# EAGLE design 10001_msp430_bsl_programmer (EAGLE 9.0.1)
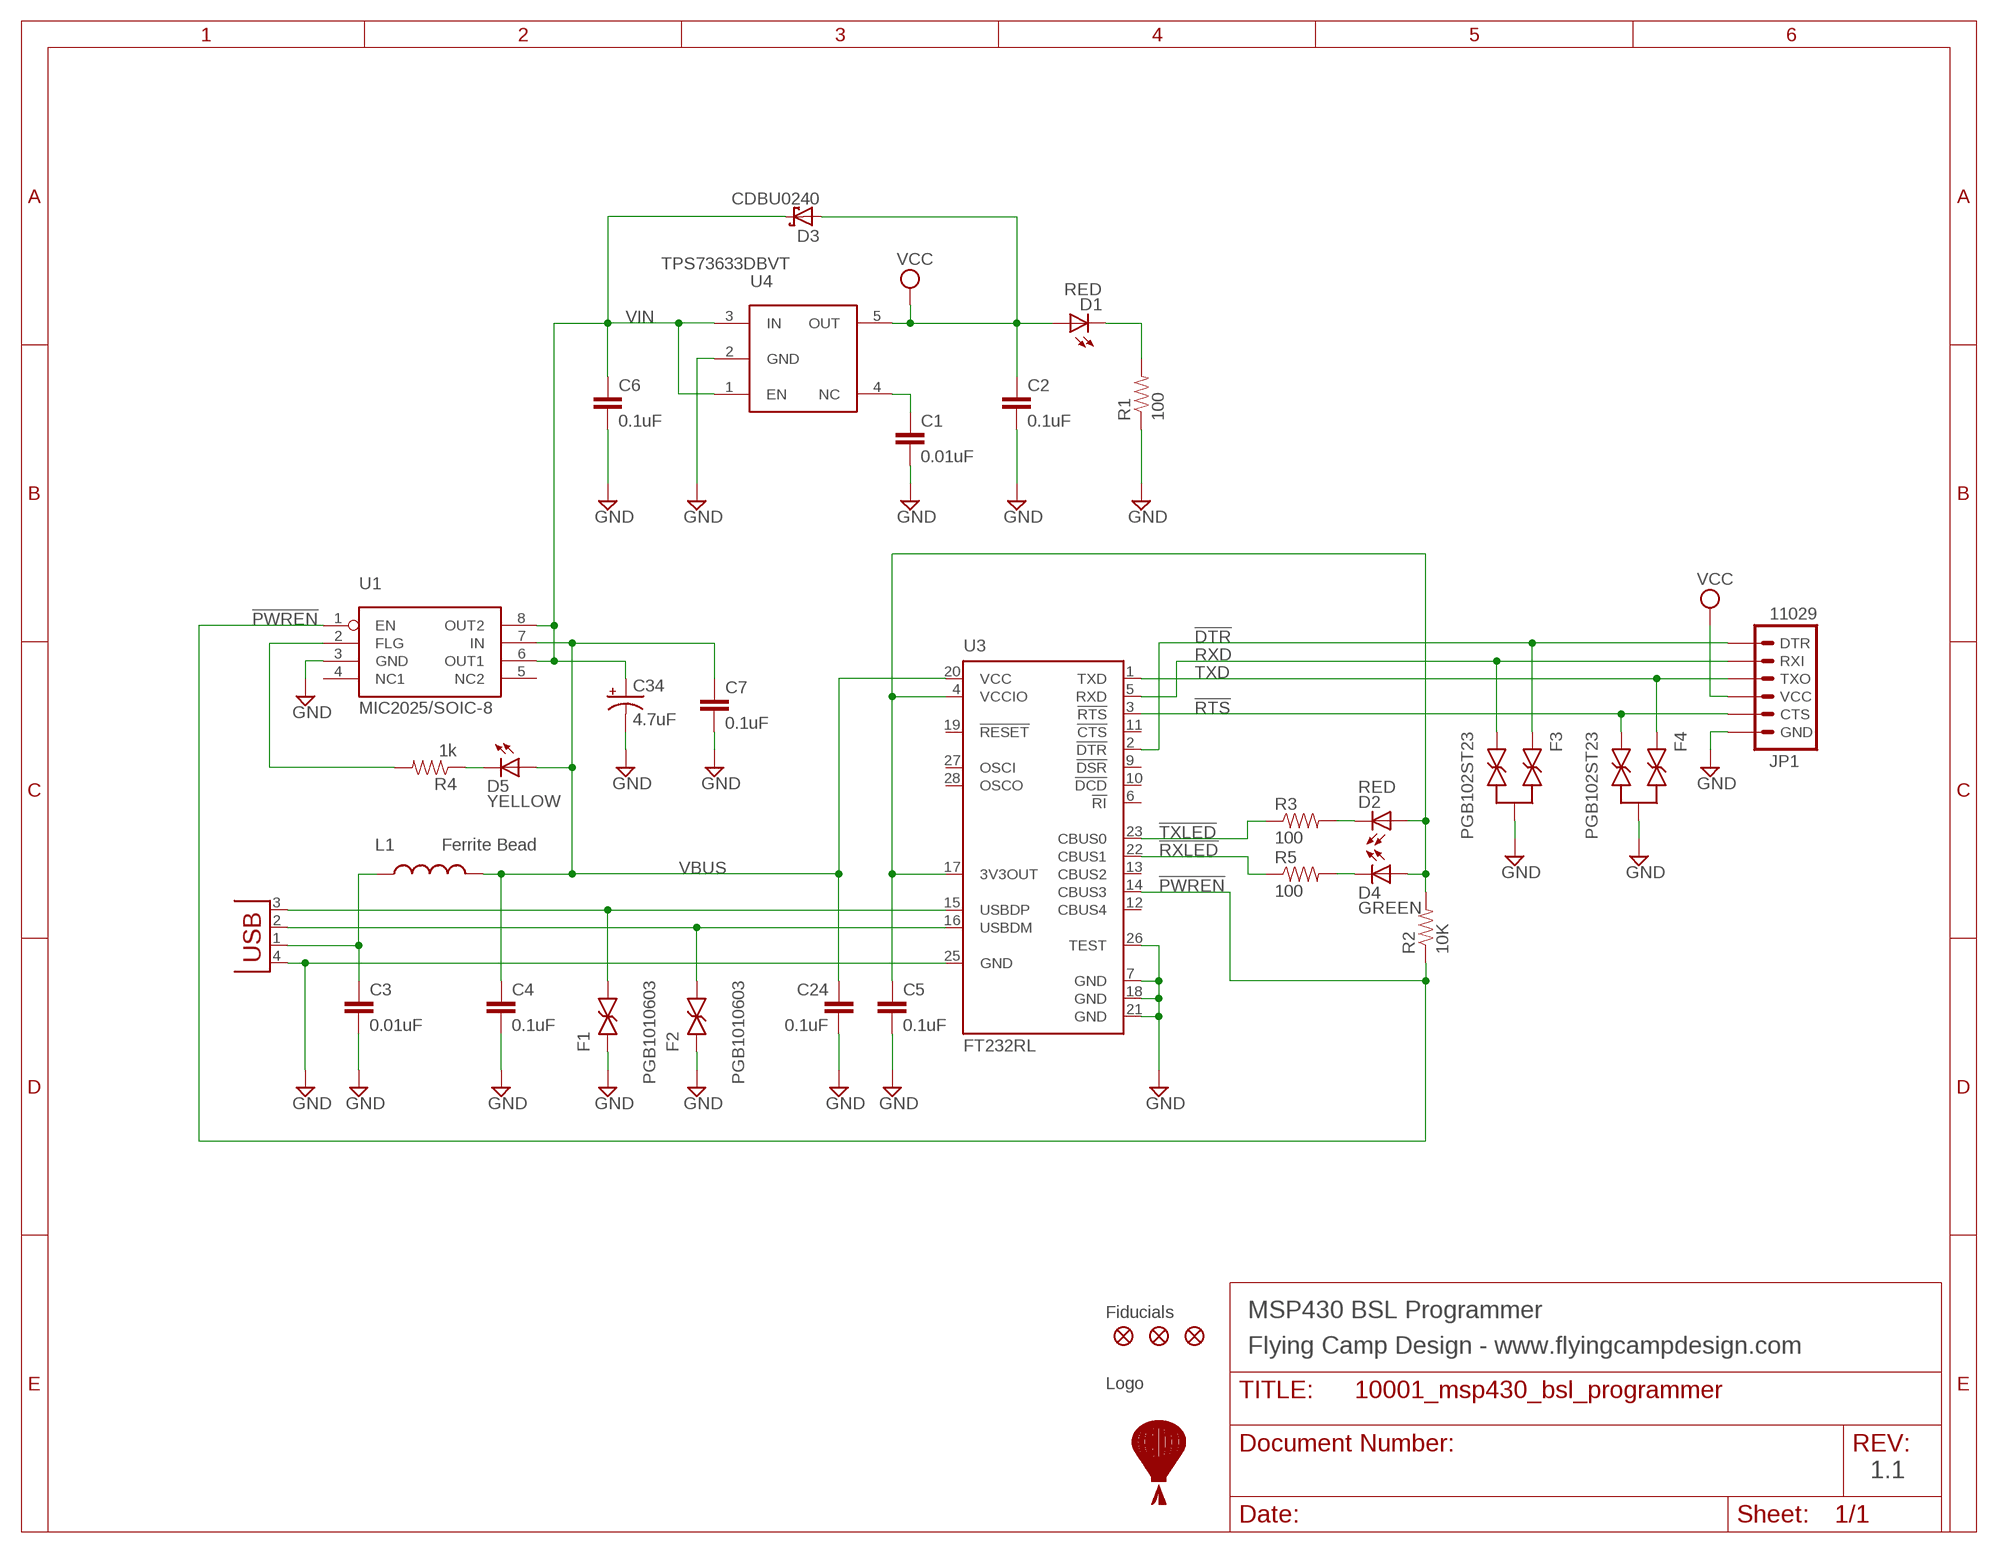
[diagram p0: schematic, sheet 1]

## Parts
C1  0.01uF  CAPACITOR1608  [CAPC1608]
C2  0.1uF  CAPACITOR1608  [CAPC1608]
C3  0.01uF  CAPACITOR1608  [CAPC1608]
C4  0.1uF  CAPACITOR1608  [CAPC1608]
C5  0.1uF  CAPACITOR1608  [CAPC1608]
C6  0.1uF  CAPACITOR1608  [CAPC1608]
C7  0.1uF  CAPACITOR1608  [CAPC1608]
C24  0.1uF  CAPACITOR1608  [CAPC1608]
C34  4.7uF  CAP_POL1206  [EIA3216]
D1  RED  LED1608  [LEDC1608]
D2  RED  LED1608  [LEDC1608]
D3  CDBU0240  SCHOTTKY-DIODE0603  [D0603]
D4  GREEN  LED1608  [LEDC1608]
D5  YELLOW  LED1608  [LEDC1608]
F1  PGB1010603  LITTELFUSE_PGB1010603  [CAPC1608]
F2  PGB1010603  LITTELFUSE_PGB1010603  [CAPC1608]
F3  PGB102ST23  LITTELFUSE_PGB102ST23  [SOT23]
F4  PGB102ST23  LITTELFUSE_PGB102ST23  [SOT23]
JP1  11029  ARDUINO_SERIAL_PROGRAMSMD  [1X06-SMD]
L1  Ferrite Bead  INDUCTOR0603  [0603]
P1  MOLEX_48037-1000  [MOLEX_48037-1000]
R1  100  RESISTOR1608  [RESC1608]
R2  10K  RESISTOR1608  [RESC1608]
R3  100  RESISTOR1608  [RESC1608]
R4  1k  RESISTOR1608  [RESC1608]
R5  100  RESISTOR1608  [RESC1608]
U1  MIC2025/SOIC-8  [SOIC-8]
U3  FT232RL  [SSOP28]
U4  TPS73633DBVT  MIC5235SOT95P280-5  [SOT95P280-5]
U$1  FLYING_CAMP_DESIGN_LOGO  [FLYING_CAMP_DESIGN_LOGO]
U$2  FIDUCIAL1X2  [FIDUCIAL-1X2]
U$3  FIDUCIAL1X2  [FIDUCIAL-1X2]
U$4  FIDUCIAL1X2  [FIDUCIAL-1X2]

## Nets
!DTR: F3.1 JP1.1(DTR) U3.2(!DTR)
!PWREN: R2.1 U1.1(EN) U3.14(CBUS3)
!RTS: F4.2 JP1.5(CTS) U3.3(!RTS)
!RXLED: R5.1 U3.22(CBUS1)
!TXLED: R3.1 U3.23(CBUS0)
D+: F1.2 P1.3(D+) U3.15(USBDP)
D-: F2.2 P1.2(D-) U3.16(USBDM)
GND [power]: C1.2 C2.2 C3.2 C4.2 C5.2 C6.2 C7.2 C24.2 C34.C(-) F1.1 F2.1 F3.3 F4.3 JP1.6(GND) P1.4(GND) R1.1 U1.3(GND) U3.7(GND) U3.18(GND) U3.21(GND) U3.25(GND) U3.26(TEST) U4.2(GND)
N$1: D1.C R1.2
N$2: C1.1 U4.4(NC)
N$3: R4.2 U1.2(FLG)
N$4: D5.C R4.1
N$34: D2.C R3.2
N$35: D4.C R5.2
RXD: F3.2 JP1.2(RXI) U3.5(RXD)
TXD: F4.1 JP1.3(TXO) U3.1(TXD)
VBUS: C4.1 C7.1 C24.1 D5.A L1.2 U1.7(IN) U3.20(VCC)
VCC: C2.1 D1.A D3.A JP1.4(VCC) U4.5(OUT)
VCCIO: C5.1 D2.A D4.A R2.2 U3.4(VCCIO) U3.17(3V3OUT)
VIN: C6.1 C34.A(+) D3.C U1.6(OUT1) U1.8(OUT2) U4.1(EN) U4.3(IN)
VUSB: C3.1 L1.1 P1.1(VBUS)
Unconnected: U1.4(NC1) U1.5(NC2) U3.6(!RI) U3.9(!DSR) U3.10(!DCD) U3.11(!CTS) U3.12(CBUS4) U3.13(CBUS2) U3.19(!RESET) U3.27(OSCI) U3.28(OSCO)

## Notes on the sheet
- Fiducials | MSP430 BSL Programmer
- Flying Camp Design - www.flyingcampdesign.com
- Logo
- 1.1

## Library data of the parts
C1-C7 C24 = cwilson:CAPACITOR: Capacitor
C34 = SparkFun:CAP_POL: Capacitor Polarized These are standard SMD and PTH capacitors. Normally 10uF, 47uF, and 100uF in electrolytic and tantalum varieties. Always verify the external diameter of the through hole cap, it varies with capacity, voltage, and manufacturer. The EIA devices should be standard.
D1 D2 D4 D5 = cwilson:LED: LED
D3 = cwilson-old:SCHOTTKY-DIODE: Schottky Diode
F1 F2 = cwilson:LITTELFUSE_PGB1010603
F3 F4 = cwilson-old:LITTELFUSE_PGB102ST23
JP1 = SparkFun:ARDUINO_SERIAL_PROGRAM
L1 = SparkFun:INDUCTOR: Inductors Basic Inductor/Choke - 0603 and 1206. Footprints are not proven and vary greatly between part numbers.
P1 = cwilson-old:MOLEX_48037-1000
R1-R5 = cwilson:RESISTOR: Resistor
U1 = cwilson-old:MIC2025
U3 = cwilson-old:FT232R: Source: http://www.ftdichip.com/Documents/DataSheets/DS_FT232R_v104.pdf
U4 = cwilson:MIC5235
U$1 = flying_camp_design:FLYING_CAMP_DESIGN_LOGO
U$2-U$4 = SparkFun:FIDUCIAL: Fiducial Alignment Points Various fiducial points for machine vision alignment.

## Net classes
1 power: width 0.635 mm, clearance 0.406 mm

## Board
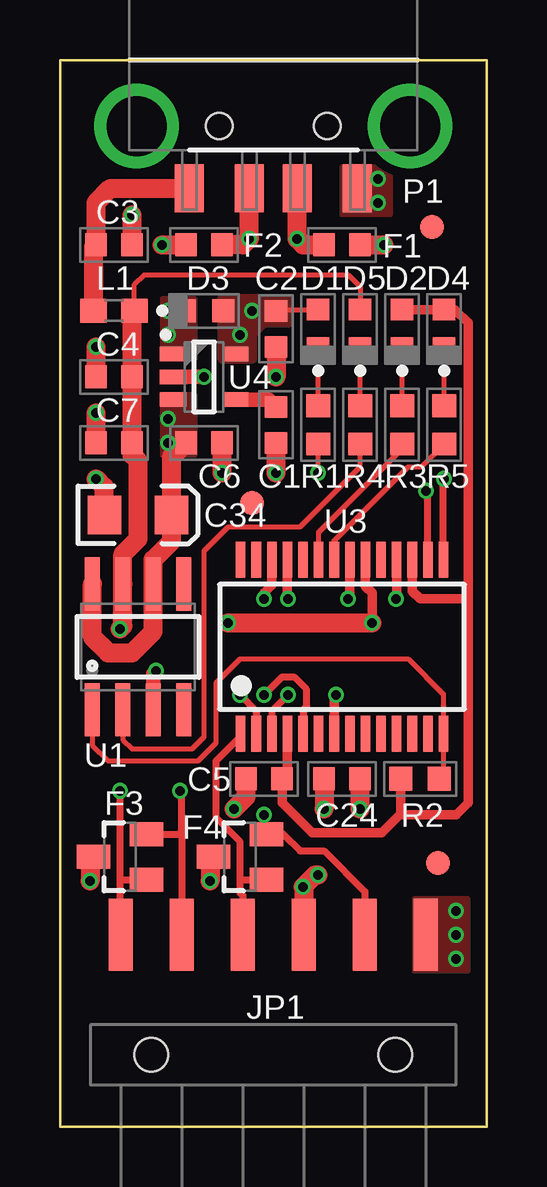
[diagram p1: board, top side]
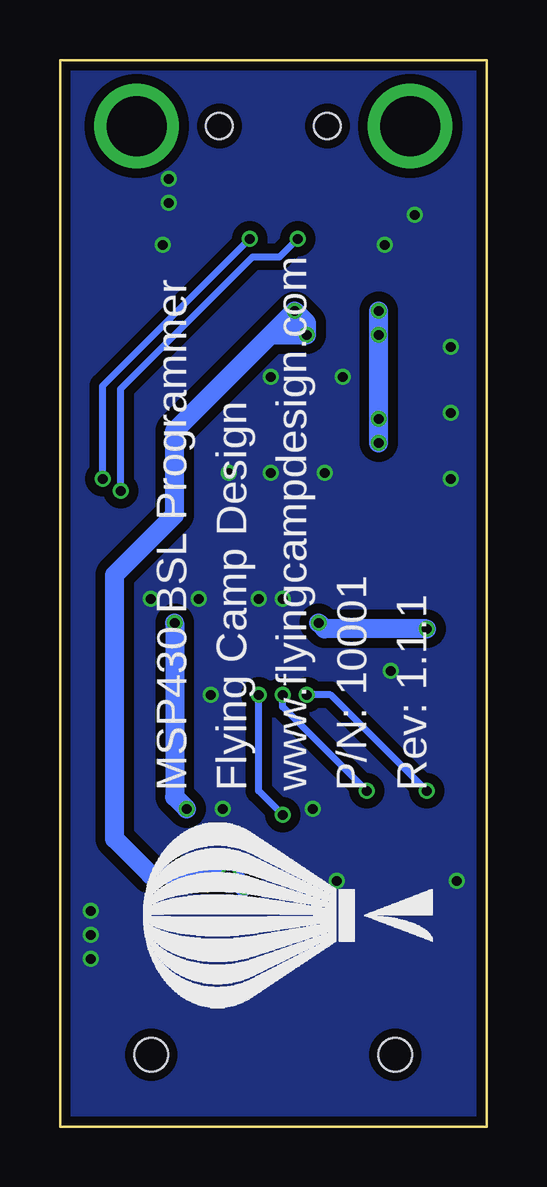
[diagram p2: board, bottom side, seen from below]

Size 17.78 x 44.45 mm. Coordinates in mm from the lower left corner, seen from the top.
Outline: 0,0 0,44.45 17.78,44.45 17.78,0 0,0
Copper layers (1*16): Top 0.0356mm / dielectric 1.5062mm / Bottom 0.0356mm
Design rules "33each": minimum track width 6mil, minimum drill 15mil, track to track 6mil, track to pad 6mil, pad to pad 6mil, via to via 6mil, smd to smd 6mil, copper to edge 15mil, drill to drill 0mil, minimum pad ring 7mil, minimum via ring 5mil, stop-mask expansion 2.5mil, vias tented up to drill 20mil, thermal gap 10mil

### Footprints (pad centres in the part's own frame; a part is rotated, then mirrored left to right if it is on the bottom)
CAPC1608 = smd 0.9 x 0.95: 1 -0.75,0; 2 0.75,0
EIA3216 = smd 1.4 x 1.6: A 1.4,0; C -1.4,0
LEDC1608 = smd 0.9 x 0.95: A 0.8,0; C -0.8,0
D0603 = smd 0.9 x 0.95: A 0.8,0; C -0.8,0
SOT23 = smd 1 x 1.4: 1 -0.95,-1.1; 2 0.95,-1.1; 3 0,1.1
1X06-SMD = smd 1 x 3: 1 -6.35,5; 2 -3.81,5; 3 -1.27,5; 4 1.27,5; 5 3.81,5; 6 6.35,5 | hole 1.4: -5.08,0; 5.08,0
0603 = smd 1.1 x 1: 1 -0.85,0; 2 0.85,0
MOLEX_48037-1000 = smd 1.2 x 2: 1 3.5,2.6; 2 1,2.6; 3 -1,2.6; 4 -3.5,2.6 | drill 2.5 pad 3.5: 5 5.7,0; 6 -5.7,0 | hole 1.1: -2.25,0; 2.25,0
RESC1608 = smd 0.95 x 1: 1 -0.8,0; 2 0.8,0
SOIC-8 = smd 0.61 x 2.21: 1 -1.905,-2.616; 2 -0.635,-2.616; 3 0.635,-2.616; 4 1.905,-2.616; 5 1.905,2.616; 6 0.635,2.616; 7 -0.635,2.616; 8 -1.905,2.616
SSOP28 = smd 0.4 x 1.5: 1 -4.225,-3.625; 2 -3.575,-3.625; 3 -2.925,-3.625; 4 -2.275,-3.625; 5 -1.625,-3.625; 6 -0.975,-3.625; 7 -0.325,-3.625; 8 0.325,-3.625; 9 0.975,-3.625; 10 1.625,-3.625; 11 2.275,-3.625; 12 2.925,-3.625; 13 3.575,-3.625; 14 4.225,-3.625; 15 4.225,3.625; 16 3.575,3.625; 17 2.925,3.625; 18 2.275,3.625; 19 1.625,3.625; 20 0.975,3.625; 21 0.325,3.625; 22 -0.325,3.625; 23 -0.975,3.625; 24 -1.625,3.625; 25 -2.275,3.625; 26 -2.925,3.625; 27 -3.575,3.625; 28 -4.225,3.625
SOT95P280-5 = smd 1.1 x 0.6: 1 -1.3,0.95; 2 -1.3,0; 3 -1.3,-0.95; 4 1.3,-0.95; 5 1.3,0.95
FIDUCIAL-1X2 = smd 1 x 1: 1 0,0

### Placement (x,y rotation side)
C1  9,29.25 270 top
C2  9,33.25 270 top
C3  2.25,36.75 0 top
C4  2.25,31.25 180 top
C5  8.5,14.5 180 top
C6  6,28.5 0 top
C7  2.25,28.5 180 top
C24  11.75,14.5 180 top
C34  3.25,25.5 0 top
D1  10.75,33.25 90 top
D2  14.25,33.25 90 top
D3  6,34 0 top
D4  16,33.25 90 top
D5  12.5,33.25 90 top
F1  11.75,36.75 180 top
F2  6,36.75 0 top
F3  2.5,11.25 90 top
F4  7.5,11.25 90 top
JP1  8.89,3 0 top
L1  2.25,34 0 top
P1  8.89,41.7 180 top
R1  10.75,29.25 90 top
R2  15,14.5 180 top
R3  14.25,29.25 90 top
R4  12.5,29.25 270 top
R5  16,29.25 90 top
U1  3.25,20 0 top
U3  11.75,20 0 top
U4  6,31.25 0 top
U$1  0.92,3.74 90 bottom
U$2  8,26 0 top
U$3  15.5,37.5 0 top
U$4  15.75,11 0 top

### Tracks (layer width: path | path; a pad name or v marks a point on that pad's centre or on a via)
!DTR  (via drill 0.4)
  Top 0.2: 2.5,8 JP1.1 | 2.5,10.25 2.55,10.3
  Top 0.3: 2.5,8 2.5,10.25 v2.5,14 | U3.2 8.18,17.32 v7.5,18 | 2.55,10.3 F3.1
  Bottom 0.3: v7.5,18 6.5,18 v2.5,14
!PWREN
  Top 0.1: 15.97,14.82 15.97,14.97 16,15 16,14.75 15.8,14.55 R2.1
  Top 0.2: R2.1 15.97,14.68 15.97,14.82 U3.14 15.97,18.02 14.5,19.5 7.5,19.5 6.5,18.5 6.5,16 5.75,15.25 2,15.25 1.34,15.9 U1.1
!RTS  (via drill 0.4)
  Top 0.2: F4.2 8.5,12.3
  Top 0.3: U3.3 8.82,17.32 v9.5,18 | JP1.5 12.7,9.8 11,11.5 10,11.5 9.3,12.2 F4.2 | 8.5,12.3 v8.5,13
  Bottom 0.3: v9.5,18 9.5,14 v8.5,13
!RXLED
  Top 0.2: R5.1 15.05,27.5 14.5,27.5 11.43,24.43 U3.22
!TXLED
  Top 0.2: U3.23 10.78,24.77 14.25,28.25 R3.1
D+  (via drill 0.4)
  Top 0.3: U3.15 15.97,26.98 v16,27
  Top 0.8: P1.3 9.89,37.02 v9.88,37 10.12,36.75 F1.2
  Bottom 0.3: v16,27 16,30.88 v9.88,37
D-  (via drill 0.4)
  Top 0.3: U3.16 15.32,26.43 v15.25,26.5
  Top 0.8: F2.2 7.62,36.75 v7.88,37 7.89,37.02 P1.2
  Bottom 0.3: v7.88,37 8.62,36.25 9.75,36.25 15.25,30.75 v15.25,26.5
GND  (via drill 0.4)
  Top 0.2: v10.75,27.25 R1.1
  Top 0.4: U3.25 9.47,22.02 v9.5,22 | U3.21 12.07,22.07 v12,22 | U3.18 14.03,22.02 v14,22 | U3.7 11.43,17.93 v11.5,18 | U3.26 8.82,22.57 8.5,22.25 v8.5,22
  Top 0.6: U4.2 v6,31.25 | U1.3 3.88,18.89 v4,19
  Top 0.8: C2.2 v9,31.25 | v9,27.25 C1.2 | C3.2 v3,38 | C4.2 v1.5,32.5 | C7.2 v1.5,29.75 | v6.75,27.25 C6.2 | C24.2 v11,13.25 | C5.2 7.75,13.75 v7.25,13.25 | v1.25,10.25 1.25,11.1 F3.3 | v6.25,10.25 6.25,11.1 F4.3 | v4.25,36.75 F2.1 | F1.1 v13.5,36.75 | C34.C 1.85,26.65 v1.5,27
  other vias: 13.25,39.5 16.5,9 16.5,7 13.25,38.5 16.5,8
  pour Bottom (isolate 0.25): 17.78,44.45 17.78,0 0,0 0,44.45
  pour Top (no thermals): 14.75,9.5 14.75,6.5 17,6.5 17,9.5
  pour Top (no thermals): 11.75,40 13.75,40 13.75,38 11.75,38
N$1
  Top 0.2: R1.2 D1.C
N$2
  Top 0.6: U4.4 8.7,30.3 C1.1
N$3
  Top 0.2: R4.2 12.5,27.5 10,25 7,25 6,24 6,16.25 5.5,15.75 3,15.75 2.62,16.14 U1.2
N$4
  Top 0.2: R4.1 D5.C
N$34
  Top 0.2: R3.2 D2.C
N$35
  Top 0.2: R5.2 D4.C
RXD  (via drill 0.4)
  Top 0.2: 5.03,12.2 5.08,12.25
  Top 0.3: JP1.2 5.08,12.25 5.08,13.92 v5,14 | F3.2 5.03,12.2 | v8.5,18 9.25,18.75 9.75,18.75 10.25,18.25 10.25,17.5 10.12,17.38 U3.5
  Bottom 0.3: v8.5,18 8.5,17.5 v5,14
TXD
  Top 0.2: 7.53,16.27 U3.1 | 7.5,10.25 7.55,10.3
  Top 0.3: 7.53,16.27 6.5,15.25 6.5,12.88 7.5,11.88 7.5,10.25 7.5,9.75 7.62,9.63 JP1.3 | 7.55,10.3 F4.1
VBUS  (via drill 0.4)
  Top 0.2: 3.1,34.1 L1.2 3.1,35.1 3.5,35.5 12,35.5 12.5,35 D5.A
  Top 0.4: U3.20 12.72,22.52 13,22.25 v13,21
  Top 0.6: 3,33.9 L1.2
  Top 0.8: v12.5,13.25 C24.1 | v2.5,20.75 2.62,20.86 U1.7 2.62,23.86 3.25,24.5 3.25,27.75 3,28 C7.1 C4.1 3,33.9 | v7,21 v13,21
  Bottom 0.8: v2.5,20.75 6.75,20.75 v7,21 | v13,21 13,13.75 v12.5,13.25
VCC  (via drill 0.4)
  Top 0.2: 9.05,34.05 D1.A
  Top 0.4: C2.1 9.05,34.05
  Top 0.8: v10.75,10.5 10.62,10.5 v10.12,10 10.16,9.96 JP1.4
  Bottom 0.8: 7.5,33.5 v7.5,33 9,33 | 7.5,33.5 v8,34 8.5,33.5 | 9,33 13,29 13,25.5 15.5,23 15.5,12 14,10.5 v10.75,10.5 10.62,10.5 v10.12,10 | 9,33 8.5,33.5 | 8.5,33.5 7.5,33.5
  pour Top (no thermals): 6.75,34.5 9.5,34.5 9.5,33.5 8.5,33.5 8,33 8,32 6.75,32
VCCIO
  Top 0.2: 14.2,13.05 14.25,13 | C5.1 9.47,14.72
  Top 0.4: 17,22 17,33.5 16.45,34.05 D4.A D2.A | U3.17 14.68,22.32 15,22 17,22 | 17,22 17,13.5 16.5,13 14.25,13 | R2.2 14.2,13.05 13.4,12.25 10.5,12.25 9.25,13.5 C5.1 | 9.47,14.72 U3.4
VIN  (via drill 0.4)
  Top 0.8: U1.8 1.34,20.41 2,19.75 3,19.75 3.88,20.64 U1.6 3.88,23.64 4.65,24.4 C34.A 4.65,27.9 C6.1
  Bottom 0.8: v4.5,28.5 v4.5,34
  other vias: 4.5,33 4.5,29.5
  pour Top (no thermals): 4.25,34.5 4.25,32 5.62,32 5.62,34.5
  pour Top (no thermals): 5.62,30.5 4.25,30.5 4.25,28 5.62,28
VUSB
  Top 0.8: L1.1 1.4,36.65 C3.1 1.5,38.5 2.1,39.1 P1.1

### Text on the board
bPlace: Rev: 1.1.1 | P/N: 10001 | www.flyingcampdesign.com | Flying Camp Design | MSP430 BSL Programmer
tNames: JP1